# Altium schematic sheet 传感.SchDoc
size A4
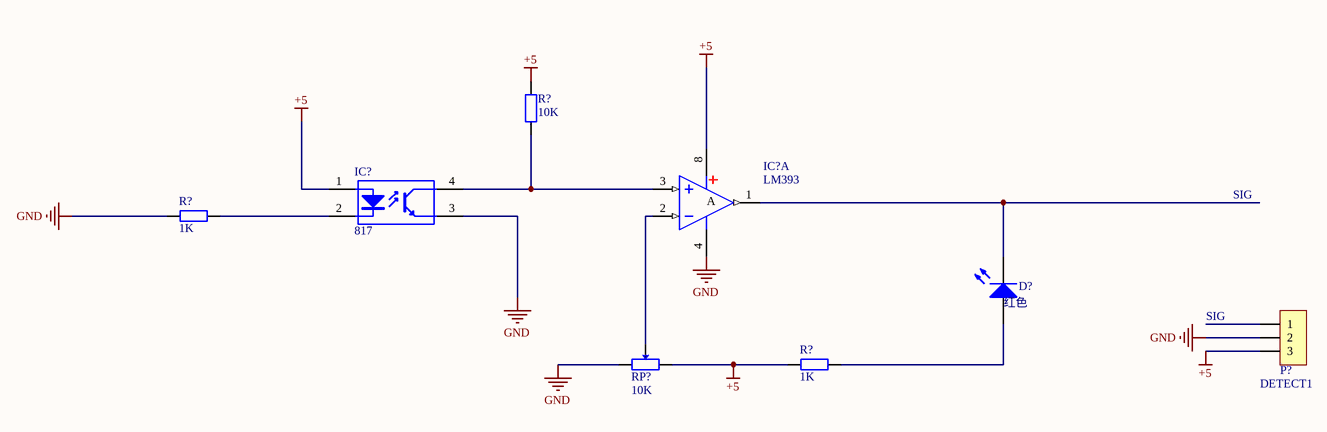
[diagram p0: 传感.SchDoc]

## Parts
(Parts that share a designator on the sheet are numbered #1, #2 ... from top to bottom, then left to right.)
D?  红色  [LED 1206R]
IC?#1  817  [DIP4-300]
IC?#2  LM393  [DIP8-300]  (part A of 2)
P?  DETECT1  [MX 1.25-WI-3P]
R?#1  10K  [R 0805_L]
R?#2  1K  [R 0805_L]
R?#3  1K  [R 0805_L]
RP?  10K  [3296W]

## Nets
+5: IC?#1.1(A) IC?#2.8(V+) P?.3 R?#1.2 R?#3.1 RP?.3
GND: IC?#1.3(E) IC?#2.4(V-) P?.2 R?#2.1 RP?.1
NetD?_1: D?.1(A) R?#3.2
NetD?_2: D?.2(K) IC?#2.1(OUT)
NetIC?#1_2: IC?#1.2(K) R?#2.2
NetIC?#1_4: IC?#1.4(C) IC?#2.3(IN+) R?#1.1
NetIC?#2_2: IC?#2.2(IN-) RP?.2

Not connected (* = marked no-connect by the designer): P? 1

## Notes on the sheet
- SIG
- (in symbol LM393, part A) A

## Library data of the parts
D? = LED: 发光二极管; 技术支持，联系售后: https://shop463601444.taobao.com
IC?#1 = 817: 线性光耦; 版权归属: 封装库来自淘宝 ID：黄晶宝石; BOM名称: 线性光耦; 学习资源: https://shop463601444.taobao.com
IC?#2 = LM393: 双路电压比较; 版权归属: 封装库来自淘宝 ID：黄晶宝石; BOM名称: 双路电压比较; 学习资源: https://shop463601444.taobao.com
P? = Header 3: 3P接插件; 联系售后: 封装库来自淘宝 ID：黄晶宝石; BOM名称: 3P接插件; 学习资源: https://shop463601444.taobao.com
R?#1-R?#3 = R: 贴片电阻; 版权归属: 来自淘宝 ID：黄晶宝石; 封装库来自淘宝卖家 ID：黄晶宝石: 其他店铺购入均为盗版，不享受售后技术支持服务，请立即申请退款; BOM名称: 贴片电阻; 联系售后: https://shop463601444.taobao.com
RP? = RP-SMD: 贴片电位器; 版权归属: 封装库来自淘宝 ID：黄晶宝石; BOM名称: 贴片电位器; 联系售后: https://shop463601444.taobao.com